# EAGLE design MHR15-inverter_current_sensors_v0 (EAGLE 6.6.0)
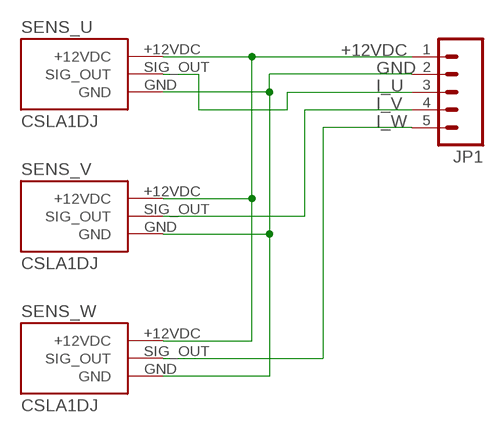
[diagram p0: schematic, sheet 1]

## Parts
JP1  M05LOCK  [1X05_LOCK]
SENS_U  CSLA1DJ  [CSLA1DJ]
SENS_V  CSLA1DJ  [CSLA1DJ]
SENS_W  CSLA1DJ  [CSLA1DJ]

## Nets
+12VDC: JP1.1 SENS_U.+12VDC SENS_V.+12VDC SENS_W.+12VDC
GND: JP1.2 SENS_U.GND SENS_V.GND SENS_W.GND
I_U: JP1.3 SENS_U.SIG_OUT
I_V: JP1.4 SENS_V.SIG_OUT
I_W: JP1.5 SENS_W.SIG_OUT

## Library data of the parts
JP1 = SparkFun-Connectors:M05: Header 5 Standard 5-pin 0.1" header. Use with straight break away headers (SKU : PRT-00116), right angle break away headers (PRT-00553), swiss pins (PRT-00743), machine pins (PRT-00117), and female headers (PRT-00115). Molex polarized connector foot print use with SKU : PRT-08230 with associated crimp pins and housings.
SENS_U SENS_V SENS_W = MHR15-TS:CSLA1DJ

## Board
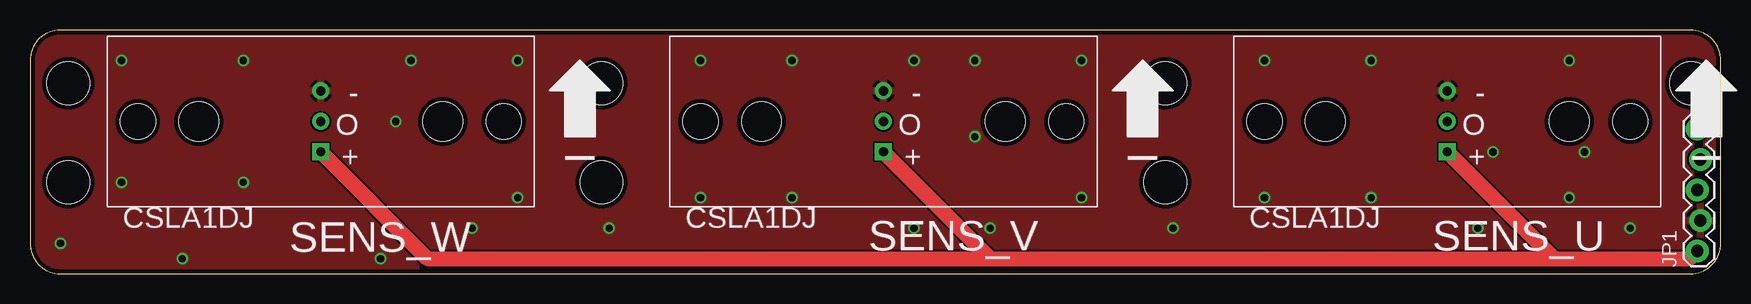
[diagram p1: board, top side]
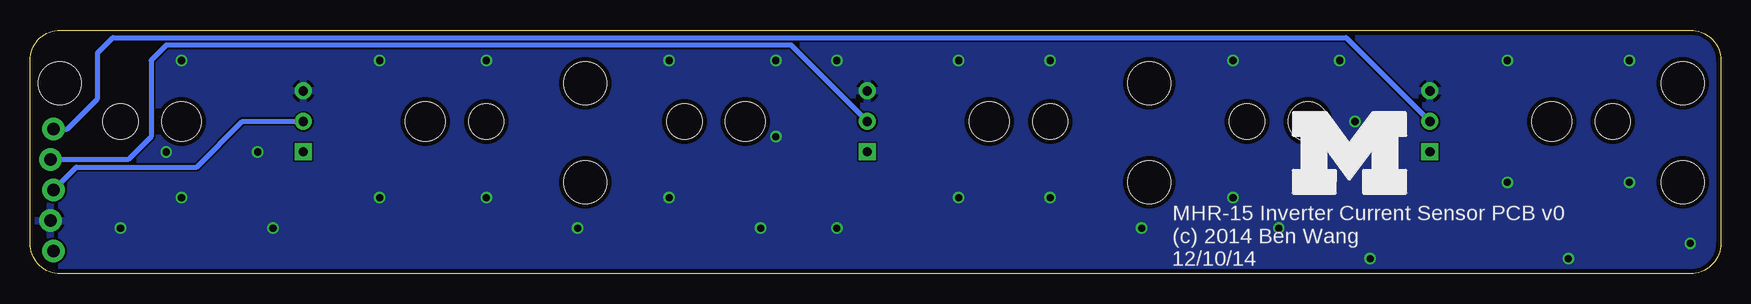
[diagram p2: board, bottom side, seen from below]

Size 140.89 x 20.32 mm. Coordinates in mm from the lower left corner, seen from the top.
Outline: 0,17.78 0,2.54 arc90 2.54,0 138.35,0 arc90 140.89,2.54 140.89,17.78 arc90 138.35,20.32 2.54,20.32 arc90 0,17.78
Copper layers (1*16): Top 0.0356mm / dielectric 1.5011mm / Bottom 0.0356mm
Design rules "LaenPCBOrder": minimum track width 6mil, minimum drill 13mil, track to track 6mil, track to pad 6mil, pad to pad 6mil, via to via 6mil, smd to smd 6mil, copper to edge 15mil, drill to drill 6mil, minimum pad ring 7mil, minimum via ring 7mil, stop-mask expansion 3mil, vias tented up to drill 0mil, thermal gap 10mil
Holes 3.56 mm at 47.62,7.62 47.62,15.88 94.61,15.88 94.61,7.62 3.17,15.88 3.17,7.62 138.43,15.88

### Footprints (pad centres in the part's own frame; a part is rotated, then mirrored left to right if it is on the bottom)
1X05_LOCK = drill 1.016 pad 1.88: 1 0,0.127; 2 2.54,-0.127; 3 5.08,0.127; 4 7.62,-0.127; 5 10.16,0.127
CSLA1DJ = drill 0.762 pad 1.422 square: +12VDC 0,-2.54 | drill 0.762 pad 1.422: GND 0,2.54; SIG_OUT 0,0 | hole 2.921: -15.24,0; 15.24,0 | hole 3.302: -10.16,0; 10.16,0

### Placement (x,y rotation side)
JP1  139.06,1.91 90 top
SENS_U  118.11,12.7 0 top
SENS_V  71.12,12.7 0 top
SENS_W  24.23,12.7 0 top

### Tracks (layer width: path | path; a pad name or v marks a point on that pad's centre or on a via)
+12VDC
  Top 1.27: 127,1.27 SENS_U.+12VDC | SENS_V.+12VDC 80.01,1.27 | 80.01,1.27 127,1.27 | SENS_W.+12VDC 33.12,1.27 80.01,1.27 | 127,1.27 138.3,1.27 JP1.1
GND  (via drill 0.6)
  other vias: 87.63,6.35 102.87,6.35 87.63,17.78 102.87,17.78 120.65,3.81 128.27,17.78 128.27,6.35 55.88,6.35 40.64,6.35 40.64,17.78 55.88,17.78 29.21,1.27 7.62,17.78 7.62,7.62 133.35,3.81 129.54,10.16 121.92,10.16 111.76,17.78 111.76,6.35 95.25,3.81 73.66,3.81 63.5,6.35 63.5,17.78 48.26,3.81 36.83,3.81 30.48,12.7 31.75,17.78 17.78,17.78 17.78,7.62 12.7,1.27 2.54,2.54 80.01,3.81 78.74,11.43 78.74,17.78 73.66,17.78
  pour Bottom: 0,20.32 142.24,20.32 142.24,0 0,0
  pour Top: -1.27,21.59 142.24,21.59 142.24,-1.27 -1.27,-1.27
I_U
  Bottom 0.406: JP1.3 137.03,8.89 127,8.89 123.19,12.7 SENS_U.SIG_OUT
I_V
  Bottom 0.406: SENS_V.SIG_OUT 77.47,19.05 129.54,19.05 130.81,17.78 130.81,11.43 132.72,9.53 JP1.4
I_W
  Bottom 0.406: JP1.5 137.79,12.06 135.25,14.61 135.25,18.41 133.99,19.68 31.22,19.68 SENS_W.SIG_OUT

### Text on the board
bNames: MHR-15 Inverter Current Sensor PCB v0 / (c) 2014 Ben Wang / 12/10/14